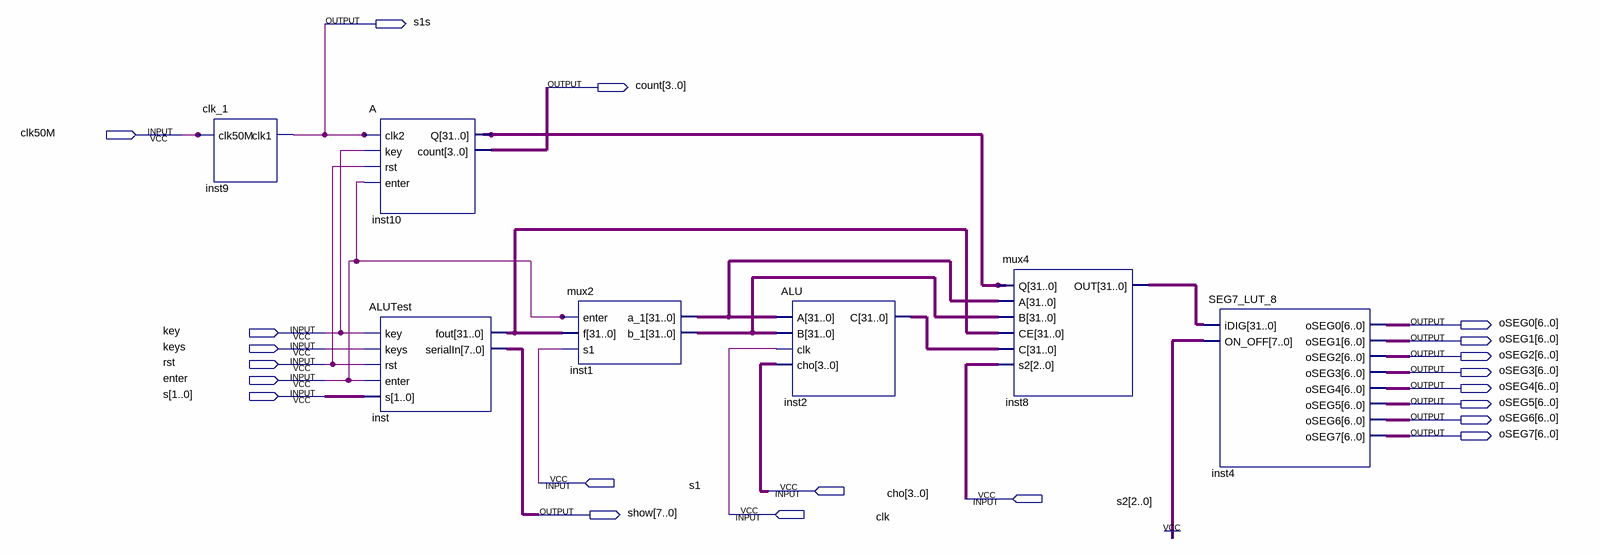
[diagram p0: schematic sheet]
// Quartus schematic Block3.bdf as structural Verilog: 7 symbols, 21 pins
module Block3 (
  input  clk50M,
  input  key,
  input  keys,
  input  rst,
  input  enter,
  input  [1:0] s,
  input  s1,
  input  [3:0] cho,
  input  [2:0] s2,
  input  clk,
  output s1s,
  output [3:0] count,
  output [6:0] oSEG0,
  output [6:0] oSEG1,
  output [6:0] oSEG2,
  output [6:0] oSEG3,
  output [6:0] oSEG4,
  output [6:0] oSEG5,
  output [6:0] oSEG6,
  output [6:0] oSEG7,
  output [7:0] show
);

  wire [31:0] inst1_a_1, inst1_b_1, inst2_c, inst8_out, inst10_q, inst_fout;

  clk_1 inst9 (.clk50M(clk50M), .clk1(s1s));
  A inst10 (.clk2(s1s), .key(key), .rst(rst), .enter(enter), .Q(inst10_q), .count(count));
  ALUTest inst (.key(key), .keys(keys), .rst(rst), .enter(enter), .s(s), .fout(inst_fout), .serialIn(show));
  mux2 inst1 (.enter(enter), .f(inst_fout), .s1(s1), .a_1(inst1_a_1), .b_1(inst1_b_1));
  ALU inst2 (.A(inst1_a_1), .B(inst1_b_1), .clk(clk), .cho(cho), .C(inst2_c));
  mux4 inst8 (.Q(inst10_q), .A(inst1_a_1), .B(inst1_b_1), .CE(inst_fout), .C(inst2_c), .s2(s2), .OUT(inst8_out));
  SEG7_LUT_8 inst4 (
    .iDIG(inst8_out), .ON_OFF({8{1'b1}}), .oSEG0(oSEG0), .oSEG1(oSEG1), .oSEG2(oSEG2), .oSEG3(oSEG3),
    .oSEG4(oSEG4), .oSEG5(oSEG5), .oSEG6(oSEG6), .oSEG7(oSEG7));
endmodule
